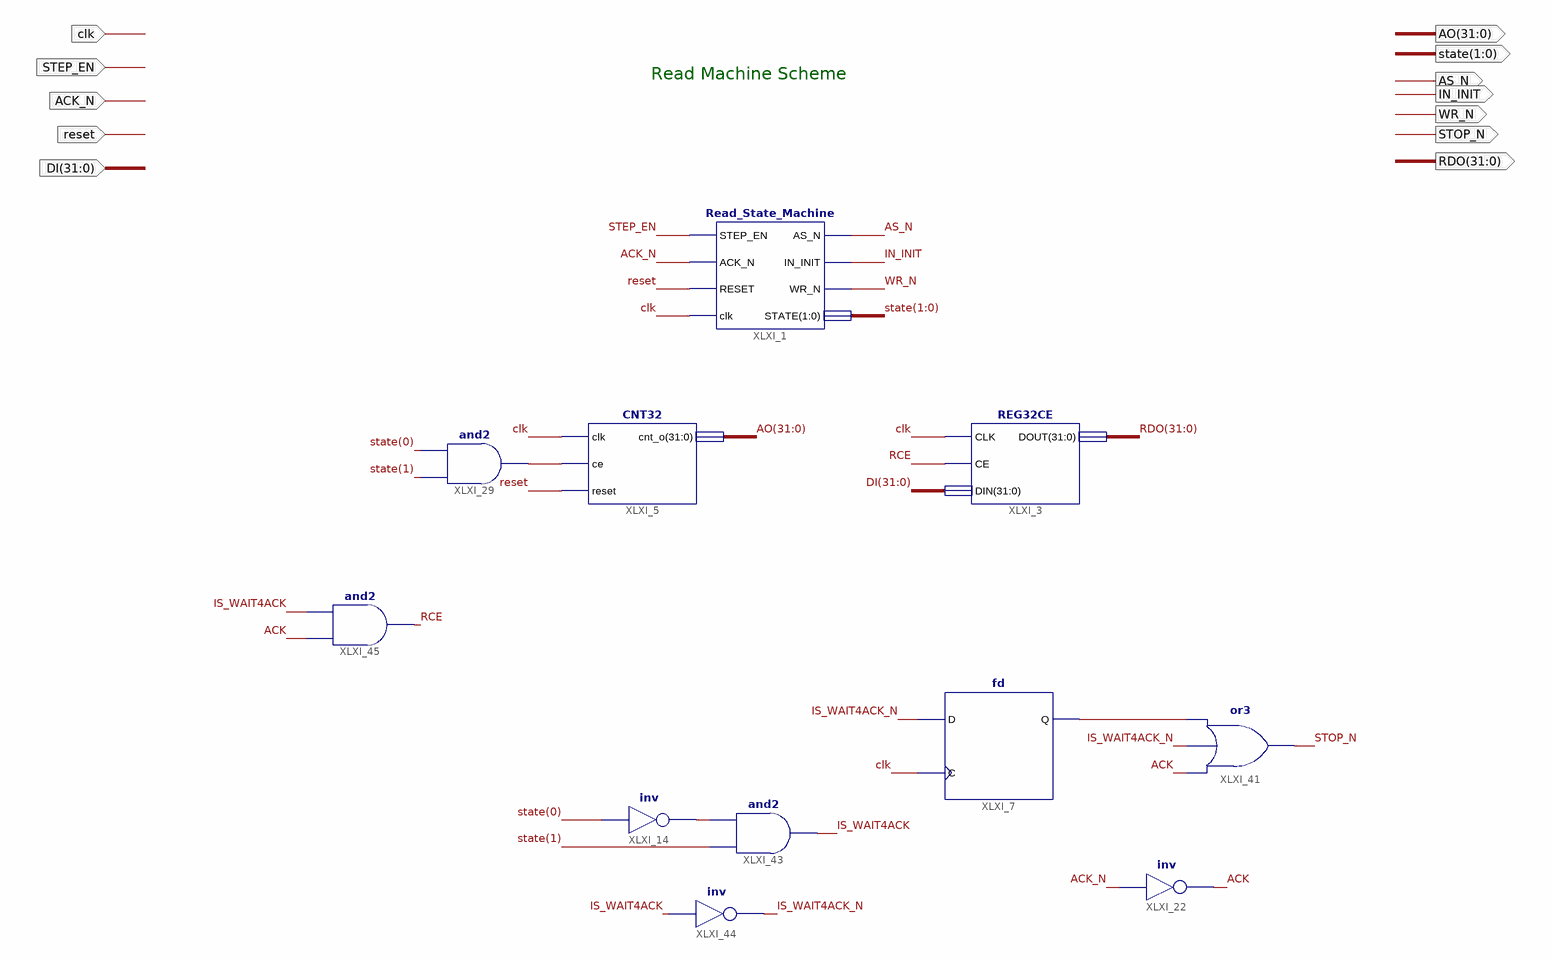
[diagram p0: schematic sheet 1]
// Xilinx ISE schematic Read_Machine.sch (spartan6) as structural Verilog: 11 symbols, 12 ports
module Read_Machine (
  input  STEP_EN,
  input  clk,
  input  ACK_N,
  input  reset,
  input  [31:0] DI,
  output STOP_N,
  output [31:0] AO,
  output [1:0] state,
  output AS_N,
  output IN_INIT,
  output WR_N,
  output [31:0] RDO
);

  wire ACK, IS_WAIT4ACK, IS_WAIT4ACK_N, RCE, XLXN_19, XLXN_46, XLXN_100;

  Read_State_Machine XLXI_1 (
    .STEP_EN(STEP_EN), .ACK_N(ACK_N), .RESET(reset), .clk(clk), .AS_N(AS_N), .IN_INIT(IN_INIT), .WR_N(WR_N),
    .STATE(state));
  REG32CE XLXI_3 (.CLK(clk), .CE(RCE), .DIN(DI), .DOUT(RDO));
  CNT32 XLXI_5 (.clk(clk), .ce(XLXN_19), .reset(reset), .cnt_o(AO));
  and XLXI_29 (XLXN_19, state[1], state[0]);
  not XLXI_14 (XLXN_46, state[0]);
  fd XLXI_7 (.C(clk), .D(IS_WAIT4ACK_N), .Q(XLXN_100));
  not XLXI_22 (ACK, ACK_N);
  or XLXI_41 (STOP_N, ACK, IS_WAIT4ACK_N, XLXN_100);
  and XLXI_43 (IS_WAIT4ACK, state[1], XLXN_46);
  not XLXI_44 (IS_WAIT4ACK_N, IS_WAIT4ACK);
  and XLXI_45 (RCE, ACK, IS_WAIT4ACK);

  // Notes on the sheet:
  //   Read Machine Scheme
endmodule
